# Altium schematic sheet voeding.SchDoc
size A4; SheetNumber: 2; SheetTotal: 10
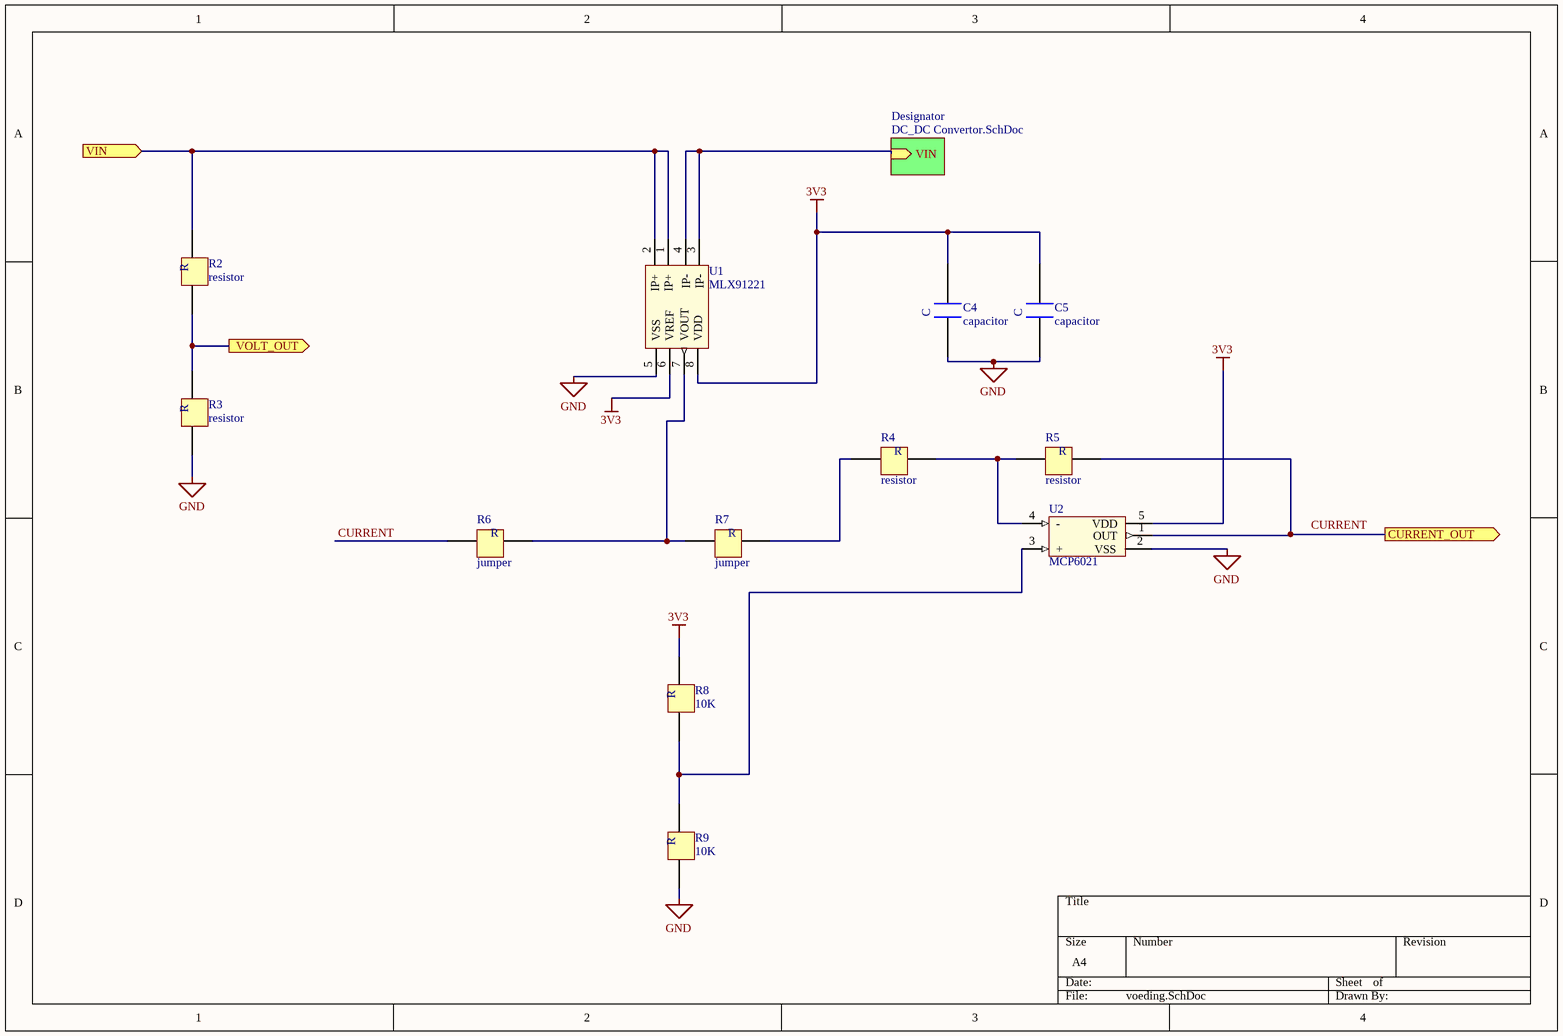
[diagram p0: voeding.SchDoc]

## Parts
C4  capacitor  [0603]
C5  capacitor  [0603]
R2  resistor  [0603]
R3  resistor  [0603]
R4  resistor  [0603]
R5  resistor  [0603]
R6  jumper  [0603]
R7  jumper  [0603]
R8  10K  [CAPC1005X04L]
R9  10K  [CAPC1005X04L]
U1  MLX91221  [SOIC8]
U2  MCP6021  [AP2112 sot25]

## Sub-sheets
Designator = DC_DC Convertor.SchDoc: VIN (in)

## Ports
CURRENT_OUT (out), VIN (in), VOLT_OUT (out)

## Nets
3V3: C4.1 C5.1 R8.1 U1.6(VREF) U1.8(VDD) U2.5(VDD)
GND: C4.2 C5.2 R3.2 R9.2 U1.5(VSS) U2.2(VSS)
CURRENT: R6.2
CURRENT_OUT: R5.1 U2.1(OUT) ; port CURRENT_OUT
VIN: R2.1 U1.1(IP+) U1.2(IP+) ; port VIN
VOLT_OUT: R2.2 R3.1 ; port VOLT_OUT
NetR4_1: R4.1 R5.2 U2.4(-)
NetR4_2: R4.2 R7.1
NetR6_1: R6.1 R7.2 U1.7(VOUT)
NetR8_2: R8.2 R9.1 U2.3(+)
NetU1_3: U1.3(IP-) U1.4(IP-) ; sheet Designator/VIN

## Notes on the sheet
- Labels drawn without touching a wire or pin: CURRENT
- (in symbol capacitor) C
- (in symbol resistor) R

## Library data of the parts
R6-R9 = resistor